# Altium schematic sheet 12_QSPI SD-Card.SchDoc
size A4; SheetNumber: 12; SheetTotal: 14
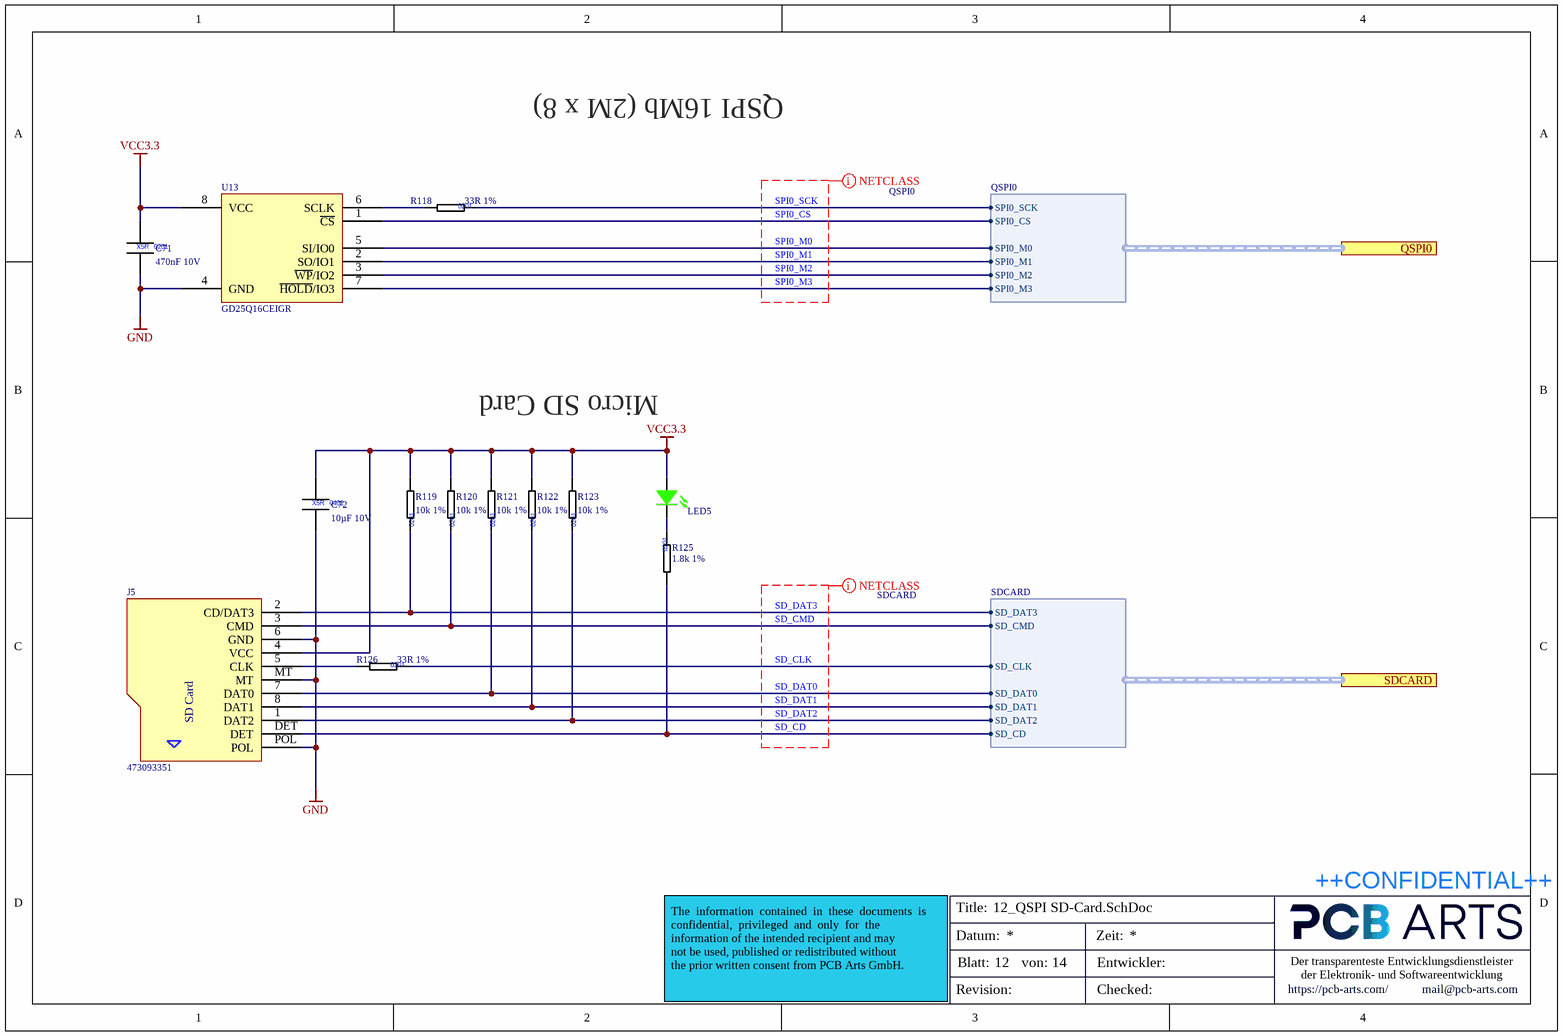
[diagram p0: 12_QSPI SD-Card.SchDoc]

## Parts
C71  470nF 10V  [CAPC0603X03L]
C72  10µF 10V  [CAPC1005X06L]
J5  473093351  [47309-3351]
LED5  150040GS73220  [WL-SMCC_0402_H=0.25mm]  (value not drawn)
R118  33R 1%  [RESC0603X03L]
R119  10k 1%  [RESC0603X03L]
R120  10k 1%  [RESC0603X03L]
R121  10k 1%  [RESC0603X03L]
R122  10k 1%  [RESC0603X03L]
R123  10k 1%  [RESC0603X03L]
R125  1.8k 1%  [RESC0603X03L]
R126  33R 1%  [RESC0603X03L]
U13  GD25Q16CEIGR  [PSON50P300X50_HS-9N]

## Ports
QSPI0 (harness QSPI0), SDCARD (harness SDCARD)

## Harnesses
QSPI0: SPI0_SCK, SPI0_CS, SPI0_M0, SPI0_M1, SPI0_M2, SPI0_M3
SDCARD: SD_DAT3, SD_CMD, SD_CLK, SD_DAT0, SD_DAT1, SD_DAT2, SD_CD

## Nets
GND: C71.2 C72.2 J5.6(GND) J5.MT J5.POL U13.4(GND)
VCC3.3: C71.1 C72.1 J5.4(VCC) LED5.2 R119.2 R120.2 R121.2 R122.2 R123.2 U13.8(VCC)
SD_CD: J5.DET R125.2 ; port SDCARD.SD_CD
SD_CLK: R126.1 ; port SDCARD.SD_CLK
SD_CMD: J5.3(CMD) R120.1 ; port SDCARD.SD_CMD
SD_DAT0: J5.7(DAT0) R121.1 ; port SDCARD.SD_DAT0
SD_DAT1: J5.8(DAT1) R122.1 ; port SDCARD.SD_DAT1
SD_DAT2: J5.1(DAT2) R123.1 ; port SDCARD.SD_DAT2
SD_DAT3: J5.2(CD/DAT3) R119.1 ; port SDCARD.SD_DAT3
SPI0_CS: U13.1(~{CS}) ; port QSPI0.SPI0_CS
SPI0_M0: U13.5(SI/IO0) ; port QSPI0.SPI0_M0
SPI0_M1: U13.2(SO/IO1) ; port QSPI0.SPI0_M1
SPI0_M2: U13.3(~{WP}/IO2) ; port QSPI0.SPI0_M2
SPI0_M3: U13.7(~{HOLD}/IO3) ; port QSPI0.SPI0_M3
SPI0_SCK: R118.1 ; port QSPI0.SPI0_SCK
NetJ5_5: J5.5(CLK) R126.2
NetLED5_1: LED5.1 R125.1
NetR118_2: R118.2 U13.6(SCLK)

## Layout directives
net class QSPI0: SPI0_CS, SPI0_M0, SPI0_M1, SPI0_M2, SPI0_M3, SPI0_SCK
net class SDCARD: SD_CD, SD_CLK, SD_CMD, SD_DAT0, SD_DAT1, SD_DAT2, SD_DAT3

## Notes on the sheet
- QSPI 16Mb (2M x 8)
- Micro SD Card
- Title:
- ++CONFIDENTIAL++
- Datum:
- Blatt:
- von:
- Zeit:
- Entwickler:
- Der transparenteste Entwicklungsdienstleister
  der Elektronik- und Softwareentwicklung
- The  information  contained  in  these  documents  is  confidential,  privileged  and  only  for  the
  information of the intended recipient and may
  not be used, published or redistributed without
  the prior written consent from PCB Arts GmbH.
- Revision:
- Checked:
- https://pcb-arts.com/
- mail@pcb-arts.com
- (in symbol 473093351_1.10mm Pitch microSD Card Header) SD Card
- (in symbol CAP_0201_470nF_10V) X5R; 0201
- (in symbol CAP_0402_10µ_10V) X5R; 0402
- (in symbol RES_0201_1.8k_1%) 0201
- (in symbol RES_0201_10k_1%) 0201
- (in symbol RES_0201_33R_1%) 0201

## Library data of the parts
C71 = CAP_0201_470nF_10V: Multilayer Ceramic Capacitors MLCC - SMD/SMT 0201 10VDC; Manufacturer 1: Taiyo Yuden; Manufacturer 1 Prt. Nr.: LMK063BBJ474KPLF; Manufacturer 2 Prt. Nr.: C0603X5R1A474M030BC; Manufacturer 2: TDK
C72 = CAP_0402_10µ_10V: Multilayer Ceramic Capacitors MLCC - SMD/SMT 0402 10VDC; Manufacturer 1: Murata Electronics; Manufacturer 1 Prt. Nr.: GRM155R61A475MEAAD; Manufacturer 2 Prt. Nr.: LMK105BBJ475MVLF; Manufacturer 2: Taiyo Yuden
J5 = 473093351_1.10mm Pitch microSD Card Header: 1.10mm Pitch microSD Card Header with Detect Switch, Height 3.35mm, Lead-Free; Manufacturer 1: Molex; ComponentLink1 Description: Manufacturer; ComponentLink2 Description: Datasheet; ComponentLink1URL: http://www.we-online.de; ComponentLink2URL: http://katalog.we-online.de/em/datasheet/693063020911.pdf; Manufacturer 1 Prt. Nr.: 473093351
LED5 = 150040GS73220_SMD WL-SMCC SMT LED Mono-color: Standard LEDs - SMD WL-SMCC SMT LED Mono-color; Manufacturer 1: Wurth Elektronik; Manufacturer 1 Prt. Nr.: 150040GS73220
R118 R126 = RES_0201_33R_1%: Thick Film Resistors - SMD 33R OHM 1%; Manufacturer 1: Yageo; Manufacturer 1 Prt. Nr.: RC0201FR-0733RL; Manufacturer 2 Prt. Nr.: CRCW020133R0FNED; Manufacturer 2: Vishay / Dale
R119-R123 = RES_0201_10k_1%: Thick Film Resistors - SMD 10K OHM 1%; Manufacturer 1: Yageo; Manufacturer 1 Prt. Nr.: RC0201FR-0710KL; Manufacturer 2 Prt. Nr.: CRCW020110K0FNED; Manufacturer 2: Vishay / Dale
R125 = RES_0201_1.8k_1%: Thick Film Resistors - SMD 1.8K OHM 1%; Manufacturer 1: Panasonic; Manufacturer 1 Prt. Nr.: ERJ-1GNF1801C; Manufacturer 2 Prt. Nr.: CRCW02011K80FKED; Manufacturer 2: Vishay / Dale
U13 = GD25Q16CEIGR_NOR Flash 16Mbit: NOR Flash 16Mbit NOR Flash /3.3V /WSON 3*2*0.45mm /Industrial(-40 to +85 ) /T&R; Manufacturer 1: GigaDevice; Manufacturer 1 Prt. Nr.: GD25Q16CEIGR